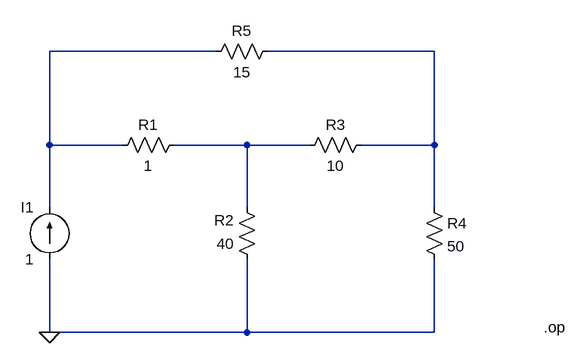
[diagram p0: schematic Lab07P01B.asc]
Lab07P01B.asc, the LTspice schematic file:
Version 4
SHEET 1 1624 680
WIRE 368 -96 112 -96
WIRE 704 -96 448 -96
WIRE 112 48 112 -96
WIRE 224 48 112 48
WIRE 416 48 304 48
WIRE 512 48 416 48
WIRE 704 48 704 -96
WIRE 704 48 592 48
WIRE 112 144 112 48
WIRE 416 144 416 48
WIRE 704 144 704 48
WIRE 112 336 112 224
WIRE 416 336 416 224
WIRE 416 336 112 336
WIRE 704 336 704 224
WIRE 704 336 416 336
FLAG 112 336 0
DATAFLAG 112 32 ""
SYMBOL current 112 224 R180
WINDOW 0 24 80 Left 2
WINDOW 3 24 0 Left 2
SYMATTR InstName I1
SYMATTR Value 1
SYMBOL res 320 32 R90
WINDOW 0 0 56 VBottom 2
WINDOW 3 32 56 VTop 2
SYMATTR InstName R1
SYMATTR Value 1
SYMBOL res 432 240 R180
WINDOW 0 36 76 Left 2
WINDOW 3 36 40 Left 2
SYMATTR InstName R2
SYMATTR Value 40
SYMBOL res 496 64 R270
WINDOW 0 32 56 VTop 2
WINDOW 3 0 56 VBottom 2
SYMATTR InstName R3
SYMATTR Value 10
SYMBOL res 688 128 R0
SYMATTR InstName R4
SYMATTR Value 50
SYMBOL res 464 -112 R90
WINDOW 0 0 56 VBottom 2
WINDOW 3 32 56 VTop 2
SYMATTR InstName R5
SYMATTR Value 15
TEXT 872 328 Left 2 !.op

The netlist it stands for:
* Lab07P01B.asc
I1 0 N001 1
R1 N003 N001 1
R2 0 N003 40
R3 N003 N002 10
R4 N002 0 50
R5 N002 N001 15
.op
.backanno
.end